# Altium project f30bms-slaveboard-tester.PrjPcb
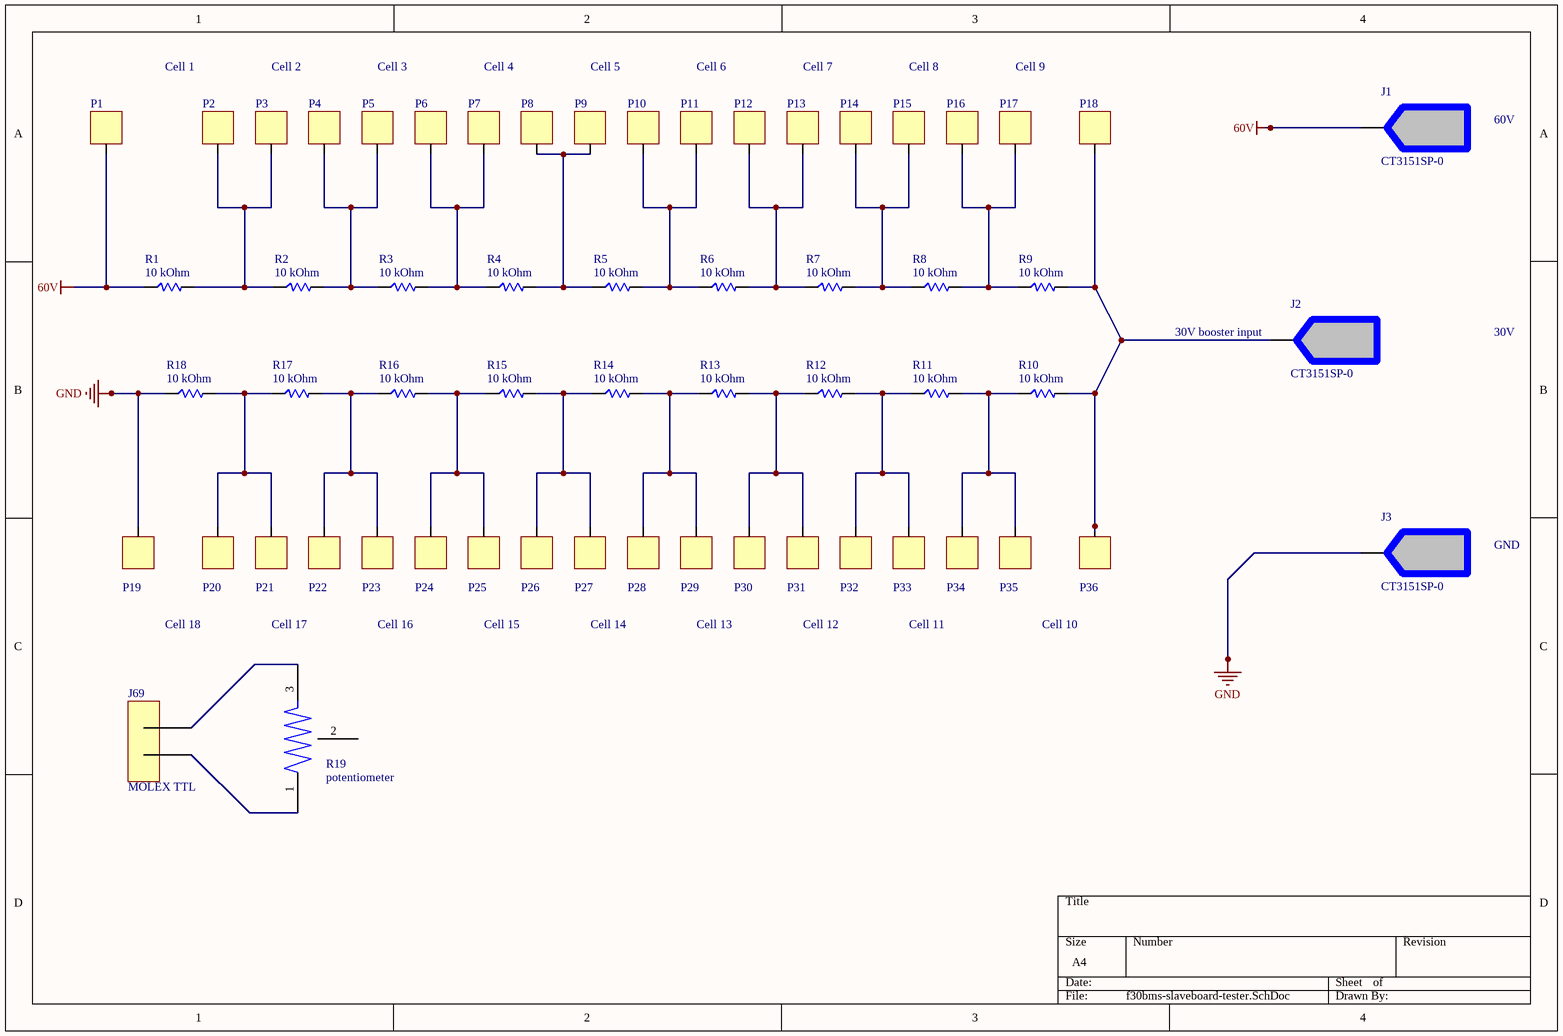
[diagram p0: f30bms-slaveboard-tester.SchDoc]
1 sheet, 59 parts. Net scope: global (net labels, ports and power ports of the same name join across sheets).
Board file: PCB1.PcbDoc

## Sheet f30bms-slaveboard-tester.SchDoc
size A4; SheetNumber: 1; SheetTotal: 1

### Parts
J1  CT3151SP-0  [CT3151SP-0]
J2  CT3151SP-0  [CT3151SP-0]
J3  CT3151SP-0  [CT3151SP-0]
J69  MOLEX TTL  [MOLEX TTL]
P1  SLAVEBOARD CONTACT  [SLAVEBOARD CONTACT]  (value not drawn)
P2  SLAVEBOARD CONTACT  [SLAVEBOARD CONTACT]  (value not drawn)
P3  SLAVEBOARD CONTACT  [SLAVEBOARD CONTACT]  (value not drawn)
P4  SLAVEBOARD CONTACT  [SLAVEBOARD CONTACT]  (value not drawn)
P5  SLAVEBOARD CONTACT  [SLAVEBOARD CONTACT]  (value not drawn)
P6  SLAVEBOARD CONTACT  [SLAVEBOARD CONTACT]  (value not drawn)
P7  SLAVEBOARD CONTACT  [SLAVEBOARD CONTACT]  (value not drawn)
P8  SLAVEBOARD CONTACT  [SLAVEBOARD CONTACT]  (value not drawn)
P9  SLAVEBOARD CONTACT  [SLAVEBOARD CONTACT]  (value not drawn)
P10  SLAVEBOARD CONTACT  [SLAVEBOARD CONTACT]  (value not drawn)
P11  SLAVEBOARD CONTACT  [SLAVEBOARD CONTACT]  (value not drawn)
P12  SLAVEBOARD CONTACT  [SLAVEBOARD CONTACT]  (value not drawn)
P13  SLAVEBOARD CONTACT  [SLAVEBOARD CONTACT]  (value not drawn)
P14  SLAVEBOARD CONTACT  [SLAVEBOARD CONTACT]  (value not drawn)
P15  SLAVEBOARD CONTACT  [SLAVEBOARD CONTACT]  (value not drawn)
P16  SLAVEBOARD CONTACT  [SLAVEBOARD CONTACT]  (value not drawn)
P17  SLAVEBOARD CONTACT  [SLAVEBOARD CONTACT]  (value not drawn)
P18  SLAVEBOARD CONTACT  [SLAVEBOARD CONTACT]  (value not drawn)
P19  SLAVEBOARD CONTACT  [SLAVEBOARD CONTACT]  (value not drawn)
P20  SLAVEBOARD CONTACT  [SLAVEBOARD CONTACT]  (value not drawn)
P21  SLAVEBOARD CONTACT  [SLAVEBOARD CONTACT]  (value not drawn)
P22  SLAVEBOARD CONTACT  [SLAVEBOARD CONTACT]  (value not drawn)
P23  SLAVEBOARD CONTACT  [SLAVEBOARD CONTACT]  (value not drawn)
P24  SLAVEBOARD CONTACT  [SLAVEBOARD CONTACT]  (value not drawn)
P25  SLAVEBOARD CONTACT  [SLAVEBOARD CONTACT]  (value not drawn)
P26  SLAVEBOARD CONTACT  [SLAVEBOARD CONTACT]  (value not drawn)
P27  SLAVEBOARD CONTACT  [SLAVEBOARD CONTACT]  (value not drawn)
P28  SLAVEBOARD CONTACT  [SLAVEBOARD CONTACT]  (value not drawn)
P29  SLAVEBOARD CONTACT  [SLAVEBOARD CONTACT]  (value not drawn)
P30  SLAVEBOARD CONTACT  [SLAVEBOARD CONTACT]  (value not drawn)
P31  SLAVEBOARD CONTACT  [SLAVEBOARD CONTACT]  (value not drawn)
P32  SLAVEBOARD CONTACT  [SLAVEBOARD CONTACT]  (value not drawn)
P33  SLAVEBOARD CONTACT  [SLAVEBOARD CONTACT]  (value not drawn)
P34  SLAVEBOARD CONTACT  [SLAVEBOARD CONTACT]  (value not drawn)
P35  SLAVEBOARD CONTACT  [SLAVEBOARD CONTACT]  (value not drawn)
P36  SLAVEBOARD CONTACT  [SLAVEBOARD CONTACT]  (value not drawn)
R1  1622796-6  [CHP0805-FX-1002ELF - duplicate]  (value not drawn)
R2  1622796-6  [CHP0805-FX-1002ELF - duplicate]  (value not drawn)
R3  1622796-6  [CHP0805-FX-1002ELF - duplicate]  (value not drawn)
R4  1622796-6  [CHP0805-FX-1002ELF - duplicate]  (value not drawn)
R5  1622796-6  [CHP0805-FX-1002ELF - duplicate]  (value not drawn)
R6  1622796-6  [CHP0805-FX-1002ELF - duplicate]  (value not drawn)
R7  1622796-6  [CHP0805-FX-1002ELF - duplicate]  (value not drawn)
R8  1622796-6  [CHP0805-FX-1002ELF - duplicate]  (value not drawn)
R9  1622796-6  [CHP0805-FX-1002ELF - duplicate]  (value not drawn)
R10  1622796-6  [CHP0805-FX-1002ELF - duplicate]  (value not drawn)
R11  1622796-6  [CHP0805-FX-1002ELF - duplicate]  (value not drawn)
R12  1622796-6  [CHP0805-FX-1002ELF - duplicate]  (value not drawn)
R13  1622796-6  [CHP0805-FX-1002ELF - duplicate]  (value not drawn)
R14  1622796-6  [CHP0805-FX-1002ELF - duplicate]  (value not drawn)
R15  1622796-6  [CHP0805-FX-1002ELF - duplicate]  (value not drawn)
R16  1622796-6  [CHP0805-FX-1002ELF - duplicate]  (value not drawn)
R17  1622796-6  [CHP0805-FX-1002ELF - duplicate]  (value not drawn)
R18  1622796-6  [CHP0805-FX-1002ELF - duplicate]  (value not drawn)
R19  potentiometer  [3361P-1-103GLF_SOP3]

### Nets
60V: J1.1 P1.1 R1.2
GND: J3.1 P19.1 R18.2
NetJ2_1: J2.1 P18.1 P36.1 R9.1 R10.1
NetJ69_1: J69.1 R19.1
NetJ69_2: J69.2 R19.3
NetP2_1: P2.1 P3.1 R1.1 R2.2
NetP4_1: P4.1 P5.1 R2.1 R3.2
NetP6_1: P6.1 P7.1 R3.1 R4.2
NetP8_1: P8.1 P9.1 R4.1 R5.2
NetP10_1: P10.1 P11.1 R5.1 R6.2
NetP12_1: P12.1 P13.1 R6.1 R7.2
NetP14_1: P14.1 P15.1 R7.1 R8.2
NetP16_1: P16.1 P17.1 R8.1 R9.2
NetP20_1: P20.1 P21.1 R17.2 R18.1
NetP22_1: P22.1 P23.1 R16.2 R17.1
NetP24_1: P24.1 P25.1 R15.2 R16.1
NetP26_1: P26.1 P27.1 R14.2 R15.1
NetP28_1: P28.1 P29.1 R13.2 R14.1
NetP30_1: P30.1 P31.1 R12.2 R13.1
NetP32_1: P32.1 P33.1 R11.2 R12.1
NetP34_1: P34.1 P35.1 R10.2 R11.1

Not connected (* = marked no-connect by the designer): R19 2

### Notes on the sheet
- Cell 1
- Cell 2
- Cell 3
- Cell 4
- Cell 5
- Cell 6
- Cell 7
- Cell 8
- Cell 9
- 60V
- (near J2) 30V booster input
- 30V
- GND
- Cell 18
- Cell 17
- Cell 16
- Cell 15
- Cell 14
- Cell 13
- Cell 12
- Cell 11
- Cell 10
- (in symbol 1622796-6) 10 kOhm

### Library data of the parts
J1-J3 = CT3151SP-0: Conn 4mm Safety Banana Jack F 1 POS Solder RA Thru-Hole 1 Port Bag; Manufacturer: Cal Test Electronics; Body Material: Nylon,Polyamide; Gender: Female; Insulation: Mating End Insulated; Supplier 1: Digi-Key; Manufacturer Part Number: CT3151SP-0; RoHS: Yes; Category: Connectors; Stock 1: 6317; Pricing 1: 1=2.05000 (USD); Mount: Through Hole,Panel; Color: Black; Contact Plating: Nickel; Contact Material: Brass; Min Operating Temperature: -20°C; Max Operating Temperature: 80°C; Termination: Solder; Packaging: Bulk; ComponentLink1URL: http://www.caltestelectronics.com/images/attachments/P315100rH_drawing.pdf?src-supplier=Digi-Key; ComponentLink1Description: http://www.caltestelectronics.com/images/attachments/P315100rH_drawing.pdf?src-supplier=Digi-Key; Supplier Part Number 1: BKCT3151SP-0-ND
R1-R18 = 1622796-6: Res Thin Film 10K Ohm 0.1% 1/4W 15ppm/C Conformal AXL Thru-Hole Ammo Pack; Manufacturer: TE Connectivity; Resistance: 10kR; Temperature Coefficient: 15ppm/°C; Max Power Dissipation: 250mW; Supplier 1: Digi-Key; Manufacturer Part Number: 1622796-6; RoHS: Yes; Category: Through-Hole Resistors; Stock 1: 35957; Pricing 1: 1=0.60000, 10=0.50300, 25=0.43120, 50=0.38800, 100=0.33780, 250=0.30184, 500=0.24436 (USD); Mount: Through Hole; Case/Package: Conformal; Min Operating Temperature: -65°C; Max Operating Temperature: 155°C; Package Quantity: 1000; Tolerance: 0.1%; Packaging: Tape and Reel; Resistor Type: Metal Film,Thin Film; Number of Terminations: 2; Termination: Axial; Series: YR, Neohm; Construction: Cylindrical; Diameter: 2.3mm; Length: 6.3mm; RoHS Compliant: Yes; Military Standard: Not; ComponentLink1URL: https://datasheet.ciiva.com/8332/eng-ds-1773265-a-8332394.pdf?src-supplier=Avnet; ComponentLink1Description: https://datasheet.ciiva.com/8332/eng-ds-1773265-a-8332394.pdf?src-supplier=Avnet; ComponentLink2URL: https://datasheet.ciiva.com/6532/eng-ds-1773265-a-6532773.pdf?src-supplier=Digi-Key; ComponentLink2Description: https://datasheet.ciiva.com/6532/eng-ds-1773265-a-6532773.pdf?src-supplier=Digi-Key; ComponentLink3URL: https://datasheet.ciiva.com/48735/eng-ds-1773265-a-48735567.pdf?src-supplier=Onlinecomponents.com; ComponentLink3Description: https://datasheet.ciiva.com/48735/eng-ds-1773265-a-48735567.pdf?src-supplier=Onlinecomponents.com; Supplier Part Number 1: A105970CT-ND